# EAGLE design lcd13264-shield (EAGLE 6.5.0)
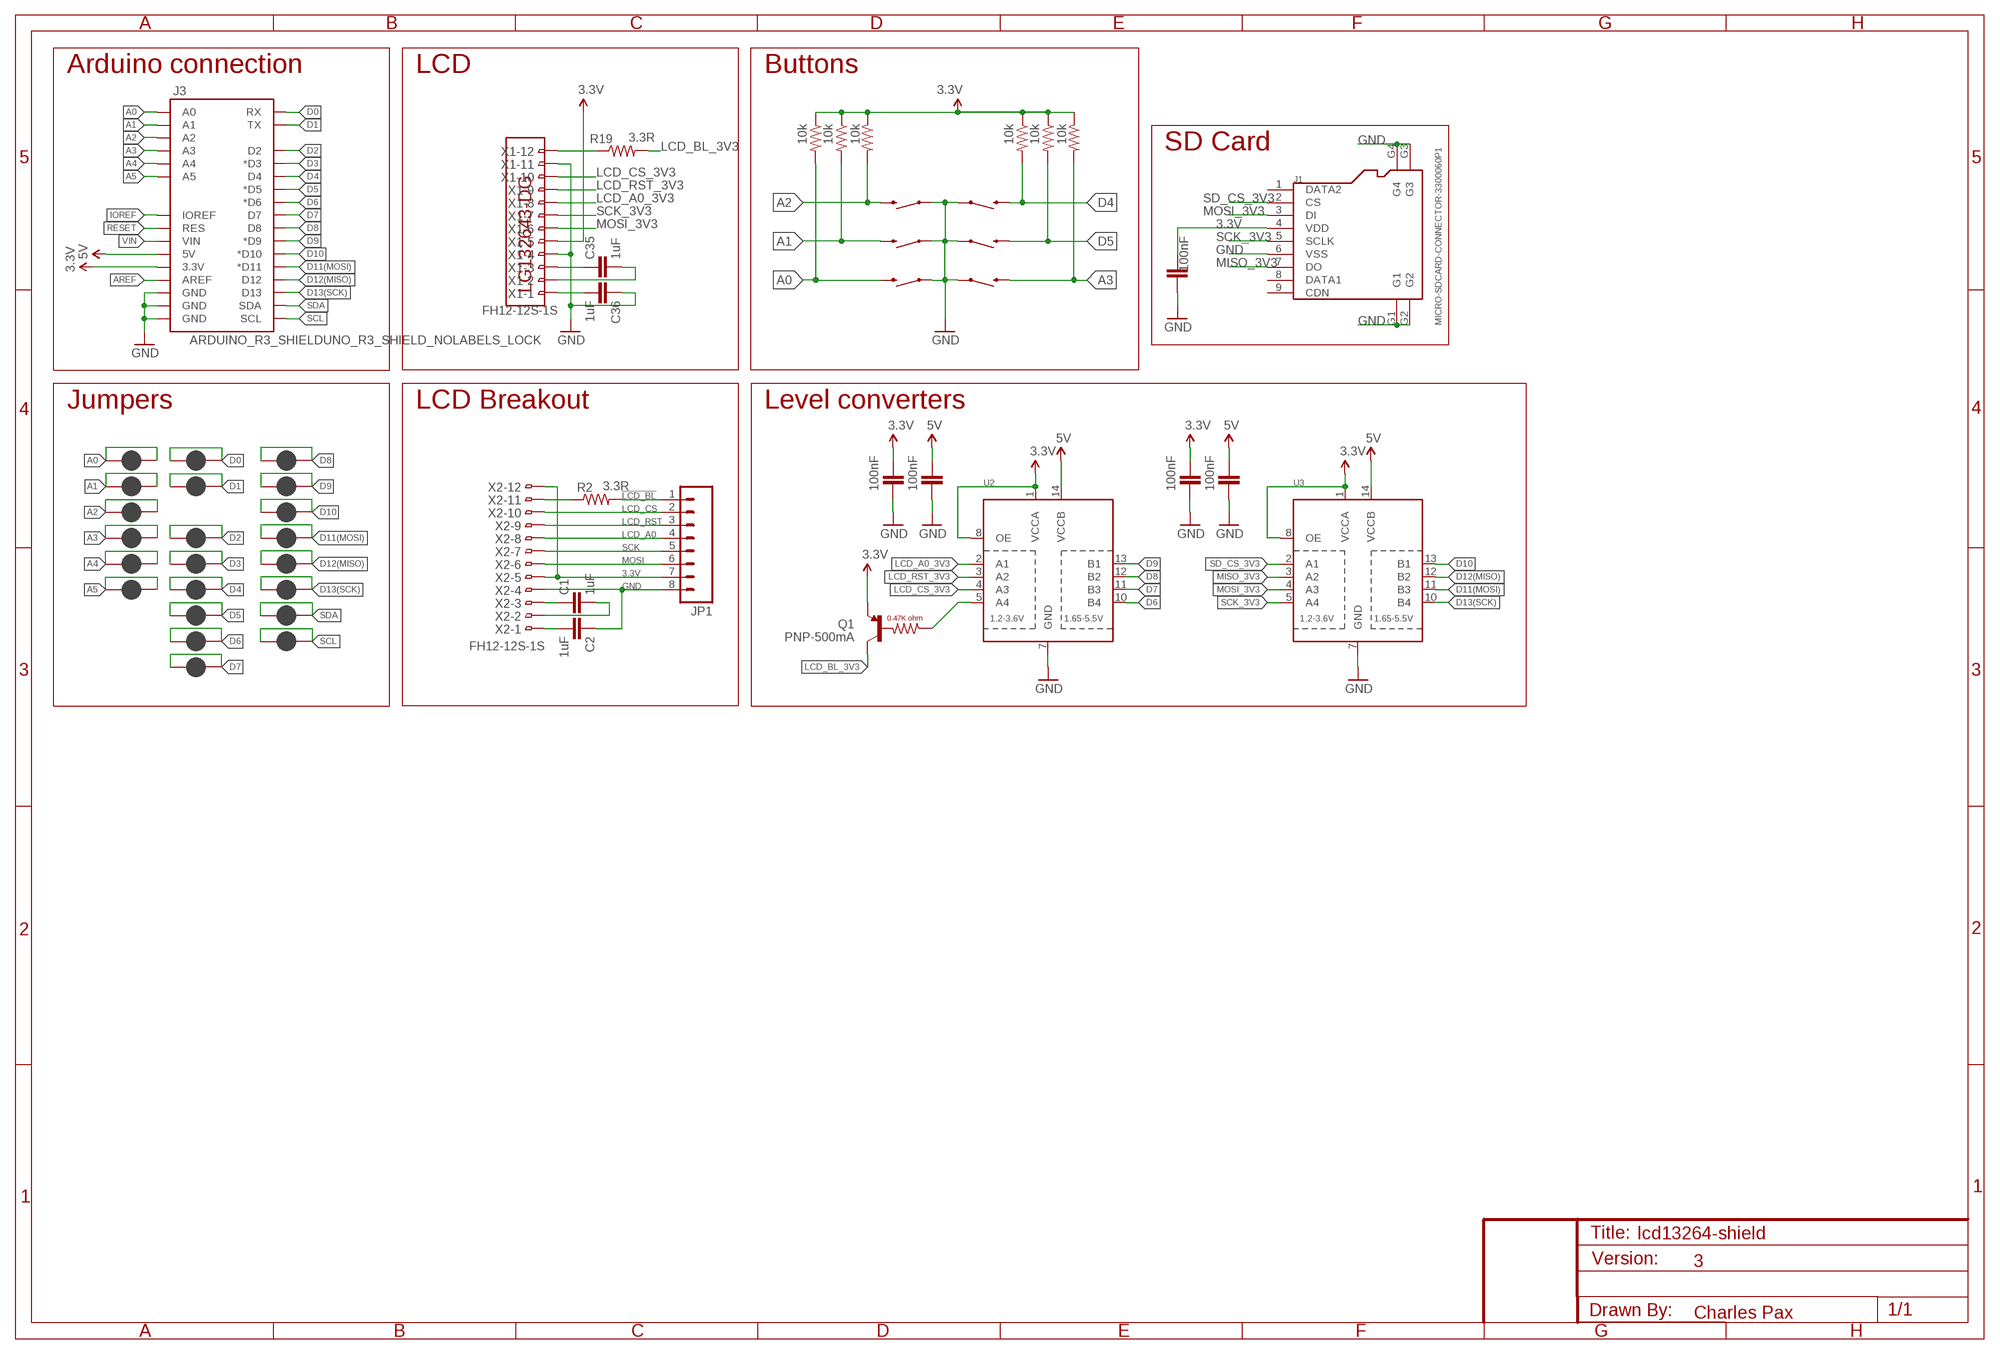
[diagram p0: schematic, sheet 1]

## Parts
C1  1uF  SPARKFUN-CAPACITORS_CAP0603-CAP  [SPARKFUN-CAPACITORS_0603-CAP]
C2  1uF  SPARKFUN-CAPACITORS_CAP0603-CAP  [SPARKFUN-CAPACITORS_0603-CAP]
C3  100nF  SPARKFUN-CAPACITORS_CAP0603-CAP  [SPARKFUN-CAPACITORS_0603-CAP]
C4  100nF  SPARKFUN-CAPACITORS_CAP0603-CAP  [SPARKFUN-CAPACITORS_0603-CAP]
C5  100nF  SPARKFUN-CAPACITORS_CAP0603-CAP  [SPARKFUN-CAPACITORS_0603-CAP]
C6  100nF  SPARKFUN-CAPACITORS_CAP0603-CAP  [SPARKFUN-CAPACITORS_0603-CAP]
C21  100nF  SPARKFUN-CAPACITORS_CAP0603-CAP  [SPARKFUN-CAPACITORS_0603-CAP]
C35  1uF  SPARKFUN-CAPACITORS_CAP0603-CAP  [SPARKFUN-CAPACITORS_0603-CAP]
C36  1uF  SPARKFUN-CAPACITORS_CAP0603-CAP  [SPARKFUN-CAPACITORS_0603-CAP]
J1  MICRO-SDCARD-CONNECTOR-3300060P1  [9P-SMD-W-RING]
J3  ARDUINO_R3_SHIELDUNO_R3_SHIELD_NOLABELS_LOCK  [UNO_R3_SHIELD_NOLABELS_LOCK]
JP1  M08  [1X08_ROUND]
Q1  PNP-500mA  TRANSISTOR-PNP-DDTB142TC  [SOT23-3]
R1  10k  SPARKFUN-RESISTORS_RESISTOR0603-RES  [SPARKFUN-RESISTORS_0603-RES]
R2  3.3R  SPARKFUN-RESISTORS_RESISTOR0603-RES  [SPARKFUN-RESISTORS_0603-RES]
R8  10k  SPARKFUN-RESISTORS_RESISTOR0603-RES  [SPARKFUN-RESISTORS_0603-RES]
R11  10k  SPARKFUN-RESISTORS_RESISTOR0603-RES  [SPARKFUN-RESISTORS_0603-RES]
R12  10k  SPARKFUN-RESISTORS_RESISTOR0603-RES  [SPARKFUN-RESISTORS_0603-RES]
R15  10k  SPARKFUN-RESISTORS_RESISTOR0603-RES  [SPARKFUN-RESISTORS_0603-RES]
R16  10k  SPARKFUN-RESISTORS_RESISTOR0603-RES  [SPARKFUN-RESISTORS_0603-RES]
R19  3.3R  SPARKFUN-RESISTORS_RESISTOR0603-RES  [SPARKFUN-RESISTORS_0603-RES]
S1  SWITCH-MOMENTARY-2SMD  [TACTILE_SWITCH_SMD]
S2  SWITCH-MOMENTARY-2SMD  [TACTILE_SWITCH_SMD]
S3  SWITCH-MOMENTARY-2SMD  [TACTILE_SWITCH_SMD]
S4  SWITCH-MOMENTARY-2SMD  [TACTILE_SWITCH_SMD]
S5  SWITCH-MOMENTARY-2SMD  [TACTILE_SWITCH_SMD]
S6  SWITCH-MOMENTARY-2SMD  [TACTILE_SWITCH_SMD]
SJ1  JUMPER-PAD-2-NC_BY_PASTE  [PAD-JUMPER-2-NC_BY_PASTE_YES_SILK]
SJ2  JUMPER-PAD-2-NC_BY_PASTE  [PAD-JUMPER-2-NC_BY_PASTE_YES_SILK]
SJ3  JUMPER-PAD-2-NC_BY_PASTE  [PAD-JUMPER-2-NC_BY_PASTE_YES_SILK]
SJ4  JUMPER-PAD-2-NC_BY_PASTE  [PAD-JUMPER-2-NC_BY_PASTE_YES_SILK]
SJ5  JUMPER-PAD-2-NC_BY_PASTE  [PAD-JUMPER-2-NC_BY_PASTE_YES_SILK]
SJ6  JUMPER-PAD-2-NC_BY_PASTE  [PAD-JUMPER-2-NC_BY_PASTE_YES_SILK]
SJ7  JUMPER-PAD-2-NC_BY_PASTE  [PAD-JUMPER-2-NC_BY_PASTE_YES_SILK]
SJ8  JUMPER-PAD-2-NC_BY_PASTE  [PAD-JUMPER-2-NC_BY_PASTE_YES_SILK]
SJ9  JUMPER-PAD-2-NC_BY_PASTE  [PAD-JUMPER-2-NC_BY_PASTE_YES_SILK]
SJ10  JUMPER-PAD-2-NC_BY_PASTE  [PAD-JUMPER-2-NC_BY_PASTE_YES_SILK]
SJ11  JUMPER-PAD-2-NC_BY_PASTE  [PAD-JUMPER-2-NC_BY_PASTE_YES_SILK]
SJ12  JUMPER-PAD-2-NC_BY_PASTE  [PAD-JUMPER-2-NC_BY_PASTE_YES_SILK]
SJ13  JUMPER-PAD-2-NC_BY_PASTE  [PAD-JUMPER-2-NC_BY_PASTE_YES_SILK]
SJ14  JUMPER-PAD-2-NC_BY_PASTE  [PAD-JUMPER-2-NC_BY_PASTE_YES_SILK]
SJ19  JUMPER-PAD-2-NC_BY_PASTE  [PAD-JUMPER-2-NC_BY_PASTE_YES_SILK]
SJ20  JUMPER-PAD-2-NC_BY_PASTE  [PAD-JUMPER-2-NC_BY_PASTE_YES_SILK]
SJ21  JUMPER-PAD-2-NC_BY_PASTE  [PAD-JUMPER-2-NC_BY_PASTE_YES_SILK]
SJ22  JUMPER-PAD-2-NC_BY_PASTE  [PAD-JUMPER-2-NC_BY_PASTE_YES_SILK]
SJ23  JUMPER-PAD-2-NC_BY_PASTE  [PAD-JUMPER-2-NC_BY_PASTE_YES_SILK]
SJ24  JUMPER-PAD-2-NC_BY_PASTE  [PAD-JUMPER-2-NC_BY_PASTE_YES_SILK]
SJ25  JUMPER-PAD-2-NC_BY_PASTE  [PAD-JUMPER-2-NC_BY_PASTE_YES_SILK]
SJ26  JUMPER-PAD-2-NC_BY_PASTE  [PAD-JUMPER-2-NC_BY_PASTE_YES_SILK]
U2  TXB0104PWRSOIC14  [SO14]
U3  TXB0104PWRSOIC14  [SO14]
U$5  LG132643-DG  [LG132643-DG]
X1  FH12-12S-1S  [FH12-12S-1SH]
X2  FH12-12S-1S  [FH12-12S-1SH]

## Nets
3.3V: C3.2 C5.2 C21.2 J1.4(VDD) J3.3.3V Q1.2(E) R1.1 R8.1 R11.1 R12.1 R15.1 R16.1 U2.1(VCCA) U2.8(OE) U3.1(VCCA) U3.8(OE) X1.5
5V: C4.2 C6.2 J3.5V U2.14(VCCB) U3.14(VCCB)
A0: J3.A0 R1.2 S6.3 SJ10.1 SJ10.2
A1: J3.A1 R16.2 S5.3 SJ7.1 SJ7.2
A2: J3.A2 R15.2 S4.3 SJ11.1 SJ11.2
A3: J3.A3 R12.2 S1.3 SJ12.1 SJ12.2
A4: J3.A4 SJ13.1 SJ13.2
A5: J3.A5 SJ14.1 SJ14.2
AREF: J3.AREF
D0: J3.RX SJ8.1 SJ8.2
D1: J3.TX SJ9.1 SJ9.2
D2: J3.D2 SJ3.1 SJ3.2
D3: J3.D3(*D3) SJ4.1 SJ4.2
D4: J3.D4 R8.2 S3.3 SJ5.1 SJ5.2
D5: J3.D5(*D5) R11.2 S2.3 SJ6.1 SJ6.2
D6: J3.D6(*D6) SJ19.1 SJ19.2 U2.10(B4)
D7: J3.D7 SJ20.1 SJ20.2 U2.11(B3)
D8: J3.D8 SJ21.1 SJ21.2 U2.12(B2)
D9: J3.D9(*D9) SJ22.1 SJ22.2 U2.13(B1)
D10: J3.D10(*D10) SJ23.1 SJ23.2 U3.13(B1)
D11(MOSI): J3.D11(*D11) SJ24.1 SJ24.2 U3.11(B3)
D12(MISO): J3.D12 SJ25.1 SJ25.2 U3.12(B2)
D13(SCK): J3.D13 SJ26.1 SJ26.2 U3.10(B4)
GND: C2.1 C3.1 C4.1 C5.1 C6.1 C21.1 C36.1 J1.6(VSS) J1.G1 J1.G2 J1.G3 J1.G4 J3.GND@0(GND) J3.GND@1(GND) J3.GND@2(GND) JP1.8 S1.1 S2.1 S3.1 S4.1 S5.1 S6.1 U2.7(GND) U3.7(GND) X1.4 X1.11 X2.4
IOREF: J3.IOREF
LCD_A0_3V3: U2.2(A1) X1.8
LCD_BL_3V3: Q1.3(C) R19.2
LCD_CS_3V3: U2.4(A3) X1.10
LCD_RST_3V3: U2.3(A2) X1.9
MISO_3V3: J1.7(DO) U3.3(A2)
MOSI_3V3: J1.3(DI) U3.4(A3) X1.6
N$4: R19.1 X1.12
N$37: C35.1 X1.3
N$38: C35.2 X1.2
N$39: C36.2 X1.1
N$40: C1.1 X2.3
N$41: C1.2 X2.2
N$42: C2.2 X2.1
N$43: R2.1 X2.11
N$47: JP1.7 X2.5 X2.12
N$51: JP1.1 R2.2
N$52: JP1.2 X2.10
N$53: JP1.3 X2.9
N$54: JP1.4 X2.8
N$55: JP1.5 X2.7
N$56: JP1.6 X2.6
N$57: Q1.1(B) U2.5(A4)
RESET: J3.RES
SCK_3V3: J1.5(SCLK) U3.5(A4) X1.7
SCL: J3.SCL SJ2.1 SJ2.2
SD_CS_3V3: J1.2(CS) U3.2(A1)
SDA: J3.SDA SJ1.1 SJ1.2
VIN: J3.VIN
Unconnected: J1.1(DATA2) J1.8(DATA1) J1.9(CDN)

## Notes on the sheet
- Arduino connection | LCD | Buttons
- SD Card
- Jumpers | LCD Breakout | Level converters
- !LCD_BL
- LCD_CS
- LCD_RST
- LCD_A0
- SCK
- MOSI
- 3.3V
- GND
- 3
- Charles Pax

## Library data of the parts
C1 C2 C35 C36 = PaxInstrument-T400:SPARKFUN-CAPACITORS_CAP: Capacitor Standard 0603 ceramic capacitor, and 0.1" leaded capacitor.; MPN: LMK107B7105KA-T; OC_DIGIKEY: 587-1242-2-ND
C3-C6 C21 = PaxInstrument-T400:SPARKFUN-CAPACITORS_CAP: Capacitor Standard 0603 ceramic capacitor, and 0.1" leaded capacitor.; MPN: CL10B104KO8NNNC; OC_DIGIKEY: 1276-1005-2-ND
J1 = PaxInstrument-T400:MICRO-SDCARD-CONNECTOR: Micro SD Card
J3 = SparkFun-Boards:ARDUINO_R3_SHIELD: Shield form compatible with the Arduino Uno R3.
JP1 = SparkFun-Connectors:M08: Header 8 Standard 8-pin 0.1" header. Use with straight break away headers (SKU : PRT-00116), right angle break away headers (PRT-00553), swiss pins (PRT-00743), machine pins (PRT-00117), and female headers (PRT-00115).
Q1 = SparkFun-DiscreteSemi:TRANSISTOR-PNP-DDTB142TC: PNP transistor with base resistor.; MPN: DDTB142TC; OC_DIGIKEY: DDTB142TC; OC_MOUSER: 621-DDTB142TC-F; PROD_ID: TRANS-11479
R1 R8 R11 R12 R15 R16 = PaxInstrument-T400:SPARKFUN-RESISTORS_RESISTOR: Resistor Basic schematic elements and footprints for 0603, 1206, and PTH resistors.; MPN: RC1608J103CS; OC_DIGIKEY: 1276-5086-2-ND
R2 R19 = PaxInstrument-T400:SPARKFUN-RESISTORS_RESISTOR: Resistor Basic schematic elements and footprints for 0603, 1206, and PTH resistors.
S1-S6 = SparkFun-Electromechanical:SWITCH-MOMENTARY-2: Various NO switches- pushbuttons, reed, etc
SJ1-SJ14 SJ19-SJ26 = SparkFun-Passives:JUMPER-PAD-2-NC_BY_PASTE
U2 U3 = SparkFun-DigitalIC:TXB0104PWR: 4-Bit Bi-Directional Level Shifter 1.2V-3.6V (VCCA) to 1.65V-5.5V (VCCB) bi-directional level shifter with auto direction sensing. Max data rate - VCCA 1.8V: 20Mbps (50ns), VCCA 3.3V: 100Mbps (10ns) Digikey: 296-21929-1-ND (TSSOP) IC-11329; MPN: TXB0104DR; OC_DIGIKEY: 296-21928-2-ND; PROD_ID: IC-11329
U$5 = charlespax:LG132643-DG; MPN: LG132643-DW
X1 X2 = PaxInstrument-T400:FH12-12S-1S

## Net classes
0 default: width 0.203 mm, drill 0.33 mm
1 power: width 0.305 mm

## Board
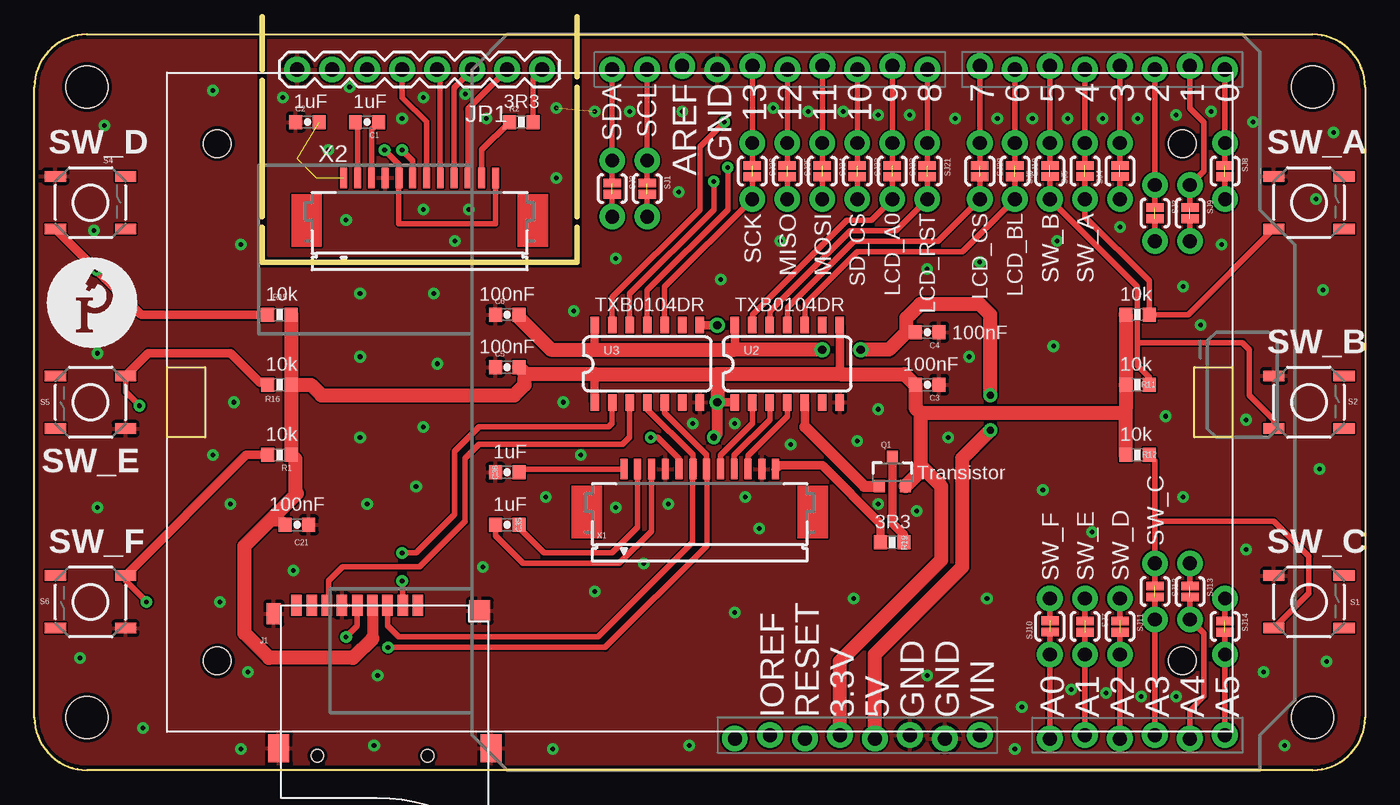
[diagram p1: board, top side]
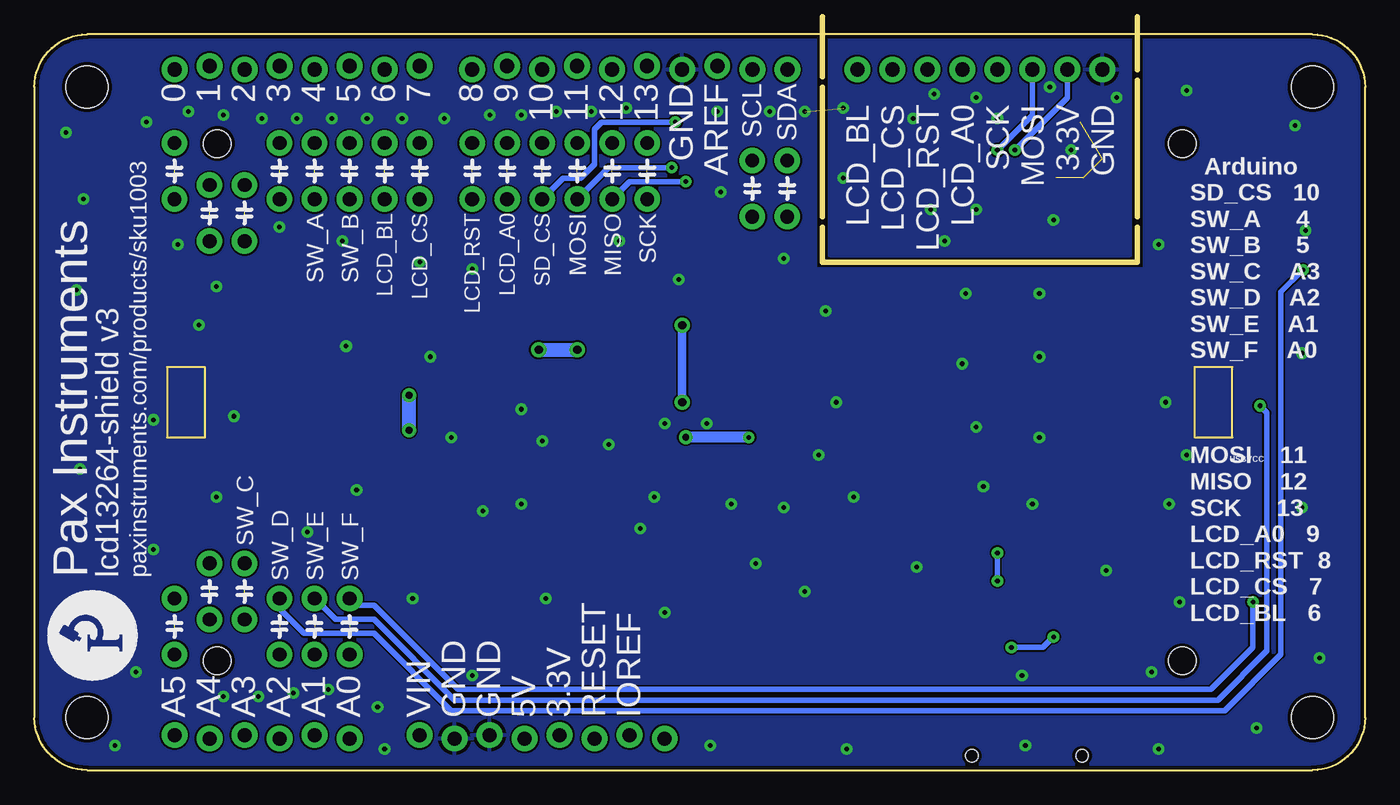
[diagram p2: board, bottom side, seen from below]

Size 96.52 x 53.34 mm. Coordinates in mm from the lower left corner, seen from the top.
Outline: 92.71,0 3.81,0 arc-90 0,3.81 0,49.53 arc-90 3.81,53.34 92.71,53.34 arc-90 96.52,49.53 96.52,3.81 arc-90 92.71,0
Copper layers (1*16): Top 0.035mm / dielectric 1.5mm / Bottom 0.035mm
Design rules "PaxInstrument-T400 *": minimum track width 6mil, minimum drill 13mil, track to track 5mil, track to pad 5mil, pad to pad 5mil, via to via 5mil, smd to smd 5mil, copper to edge 10mil, drill to drill 8mil, minimum pad ring 12mil, minimum via ring 10mil, stop-mask expansion 4mil, vias tented up to drill 25mil, thermal gap 10mil
Holes 3.05 mm at 3.81,49.53 92.71,49.53 92.71,3.81 3.81,3.81
Milling: 7 lines

### Footprints (pad centres in the part's own frame; a part is rotated, then mirrored left to right if it is on the bottom)
SPARKFUN-CAPACITORS_0603-CAP = smd 0.94 x 1.016: 1 -0.85,0; 2 0.85,0
9P-SMD-W-RING = smd 1.524 x 0.762: 1 -7.493,2.414; 2 -7.493,1.314; 3 -7.493,0.214; 4 -7.493,-0.886; 5 -7.493,-1.986; 6 -7.493,-3.086; 7 -7.493,-4.186; 8 -7.493,-5.286; 9 -7.493,-6.386 | smd 1.524 x 1.016: G1 -6.893,-8.032 | smd 2.032 x 1.524: G2 2.88,-7.686; G3 2.88,7.714 | smd 1.524 x 1.524: G4 -7.101,6.895 | hole 0.889: 3.407,-4.886; 3.407,3.114
UNO_R3_SHIELD_NOLABELS_LOCK = drill 1.016 pad 1.88: 3.3V 50.8,26.67; 5V 51.054,29.21; A0 51.054,41.91; A1 50.8,44.45; A2 51.054,46.99; A3 50.8,49.53; A4 51.054,52.07; A5 50.8,54.61; AREF 2.286,15.24; D2 2.54,49.53; D3 2.286,46.99; D4 2.54,44.45; D5 2.286,41.91; D6 2.54,39.37; D7 2.286,36.83; D8 2.54,33.02; D9 2.286,30.48; D10 2.54,27.94; D11 2.286,25.4; D12 2.54,22.86; D13 2.286,20.32; GND@0 50.8,31.75; GND@1 51.054,34.29; GND@2 2.54,17.78; IOREF 50.8,21.59; NC 51.054,19.05; RES 51.054,24.13; RX 2.54,54.61; SCL 2.54,10.16; SDA 2.54,12.7; TX 2.286,52.07; VIN 50.8,36.83
1X08_ROUND = drill 1.016 pad 1.88: 1 0,0; 2 2.54,0; 3 5.08,0; 4 7.62,0; 5 10.16,0; 6 12.7,0; 7 15.24,0; 8 17.78,0
SOT23-3 = smd 0.8 x 0.9: 1 -0.95,-1; 2 0.95,-1; 3 0,1.1
SPARKFUN-RESISTORS_0603-RES = smd 0.94 x 1.016: 1 -0.85,0; 2 0.85,0
TACTILE_SWITCH_SMD = smd 1.524 x 0.762: 1 -2.54,1.905; 2 2.54,1.905; 3 -2.54,-1.905; 4 2.54,-1.905
PAD-JUMPER-2-NC_BY_PASTE_YES_SILK = smd 0.635 x 1.27: 1 -0.401,0; 2 0.413,0
SO14 = smd 0.6 x 1.2: 1 -3.81,-2.8; 2 -2.54,-2.8; 3 -1.27,-2.8; 4 0,-2.8; 5 1.27,-2.8; 6 2.54,-2.8; 7 3.81,-2.8; 8 3.81,2.8; 9 2.54,2.8; 10 1.27,2.8; 11 0,2.8; 12 -1.27,2.8; 13 -2.54,2.8; 14 -3.81,2.8
LG132643-DG = hole 2: -35,-18.75; 35,-18.75; 35,18.75; -35,18.75
FH12-12S-1SH = smd 0.5 x 1.5: 1 -5.5,2.297; 2 -4.5,2.297; 3 -3.5,2.297; 4 -2.5,2.297; 5 -1.5,2.297; 6 -0.5,2.297; 7 0.5,2.297; 8 1.5,2.297; 9 2.5,2.297; 10 3.5,2.297; 11 4.5,2.297; 12 5.5,2.297

### Placement (x,y rotation side)
C1  24.13,46.99 180 top
C2  19.81,46.99 0 top
C3  64.77,27.94 180 top
C4  64.77,31.75 180 top
C5  34.29,29.21 0 top
C6  34.29,33.02 0 top
C21  19.05,17.78 180 top
C35  34.29,17.78 0 top
C36  34.29,21.59 0 top
J1  25.4,4.45 270 top
J3  31.75,53.34 270 top
JP1  36.83,50.8 180 top
Q1  62.23,21.59 0 top
R1  17.78,22.86 180 top
R2  35.31,46.99 0 top
R8  80.01,33.02 0 top
R11  80.01,27.94 0 top
R12  80.01,22.86 0 top
R15  17.78,33.02 180 top
R16  17.78,27.94 180 top
R19  62.23,16.51 0 top
S1  92.46,12.19 0 top
S2  92.46,26.67 0 top
S3  92.46,41.15 0 top
S4  4.06,41.15 0 top
S5  4.06,26.67 180 top
S6  4.06,12.19 180 top
SJ1  44.45,42.16 270 top
SJ2  41.91,42.16 270 top
SJ3  81.28,40.39 270 top
SJ4  78.74,43.43 90 top
SJ5  76.2,43.43 90 top
SJ6  73.66,43.43 90 top
SJ7  76.2,10.41 270 top
SJ8  86.36,43.43 270 top
SJ9  83.82,40.39 270 top
SJ10  73.66,10.41 90 top
SJ11  78.74,10.41 270 top
SJ12  81.28,12.95 270 top
SJ13  83.82,12.95 270 top
SJ14  86.36,10.41 270 top
SJ19  71.12,43.43 270 top
SJ20  68.58,43.43 270 top
SJ21  64.77,43.43 270 top
SJ22  62.23,43.43 270 top
SJ23  59.69,43.43 270 top
SJ24  57.15,43.43 270 top
SJ25  54.61,43.43 270 top
SJ26  52.07,43.43 270 top
U2  54.61,29.46 0 top
U3  44.45,29.46 0 top
U$1  [PAXINSTRUMENT_LOGO]  0.76,30.48 0 top
U$5  48.26,26.67 0 bottom
U$6  [PAXINSTRUMENT_LOGO]  88.9,6.35 90 bottom
X1  48.26,19.52 0 top
X2  27.94,40.64 0 top

### Tracks (layer width: path | path; a pad name or v marks a point on that pad's centre or on a via)
3.3V  (via drill 0.33, 0.5, 0.6)
  Top 0.406: X1.5 46.76,22.58 45.21,24.13 v44.7,24.13
  Top 0.61: U3.8 v49.53,32.26 | v49.53,26.67 v49.54,26.66 U2.1 | U3.1 40.64,28.7 | U2.8 58.42,28.7
  Top 0.813: J1.4 24.51,9.53 | 64.26,22.1 64.26,21.67 | v49.28,24.13 49.53,24.38 v49.53,26.67 | C21.2 17.95,18.03 17.02,18.03
  Top 1.016: 49.53,28.7 40.64,28.7 35.81,28.7 | 49.53,28.7 v49.53,26.67 | 49.53,28.7 58.42,28.7 63.12,28.7 63.88,27.94 C3.2 63.92,26.25 64.26,25.91 | R8.1 R11.1 79.16,26.2 | 64.26,25.91 78.86,25.91 79.16,26.2 | R15.1 R16.1 | R16.1 R1.1 18.92,22.57 18.92,19.94 | 24.51,9.53 23.11,8.13 17.02,8.13 15.24,9.91 15.24,16.26 17.02,18.03 18.92,19.94 | 18.92,19.94 19.05,20.07 | R16.1 20.07,27.94 20.83,27.18 34.8,27.18 35.56,27.94 35.56,28.45 35.81,28.7 | 64.26,25.91 64.26,22.1 65.79,20.57 65.79,15.24 58.42,7.87 J3.3.3V | 64.26,21.67 Q1.2 | R12.1 79.16,26.2 | 35.81,28.7 35.65,28.7 C5.2
  Bottom 0.61: v49.53,32.26 v49.53,26.67
  Bottom 0.813: v44.7,24.13 v49.28,24.13
5V  (via drill 0.5, 0.6)
  Top 0.61: U3.14 40.64,30.48 | 50.8,30.48 50.8,30.73 | 50.8,30.73 U2.14 | 51.05,30.48 50.8,30.73
  Top 1.016: 50.8,30.48 40.64,30.48 37.47,30.48 35.14,32.81 C6.2 | v57.15,30.48 51.05,30.48 | v59.94,30.48 61.98,30.48 63.25,31.75 | J3.5V 60.96,8.38 67.31,14.73 67.31,22.61 v69.34,24.64 | v69.34,27.18 69.34,33.02 68.58,33.78 64.26,33.78 63.25,32.77 63.25,31.75 | 63.25,31.75 C4.2
  Bottom 1.016: v59.94,30.48 v57.15,30.48 | v69.34,24.64 v69.34,27.18
A0  (via drill 0.33, 1 pad 1.85)  (1 unrouted)
  Top 0.406: J3.A0 v73.66,8.38 SJ10.1 | v73.66,12.45 SJ10.2 | v8.13,12.19 6.6,13.72 S6.3
  Top 0.61: S6.3 15.37,22.86 R1.2
  Bottom 0.406: v73.66,12.45 73.15,11.94 71.88,11.94 65.79,5.84 11.18,5.84 8.13,8.89 v8.13,12.19
A1  (via drill 0.33, 1 pad 1.85)  (1 unrouted)
  Top 0.406: v76.2,12.45 SJ7.1 | SJ7.2 v76.2,8.38 J3.A1 | v7.62,26.42 6.6,27.43 S5.3 | 16.38,28.07 16.51,27.94 R16.2
  Top 0.61: S5.3 8.26,30.23 14.22,30.23 16.38,28.07
  Bottom 0.406: v76.2,12.45 74.68,10.92 71.88,10.92 66.04,5.08 10.67,5.08 7.11,8.64 7.11,25.91 v7.62,26.42
A2  (via drill 0.33, 1 pad 1.85)  (1 unrouted)
  Top 0.406: J3.A2 v78.74,8.38 SJ11.2 | v78.74,12.45 SJ11.1
  Top 0.61: S4.3 4.25,36.51 v4.51,36.26 7.75,33.02 R15.2
  Bottom 0.406: v78.74,12.45 78.74,11.68 76.96,9.91 71.88,9.91 66.29,4.32 10.16,4.32 6.1,8.38 6.1,34.67 v4.51,36.26
A3  (via drill 1 pad 1.85)  (1 unrouted)
  Top 0.406: J3.A3 v81.28,10.92 SJ12.2 | SJ12.1 v81.28,14.99 81.28,18.03 | 81.28,18.03 81.28,21.08 81.28,21.46 81.28,22.44 R12.2 | S1.3 92.46,12.83 92.46,15.49 89.92,18.03 81.28,18.03
A4  (via drill 1 pad 1.85)  (1 unrouted)
  Top 0.406: SJ13.2 v83.82,10.92 84.84,9.91 84.84,5.33 83.82,4.32 J3.A4 | v83.82,14.99 SJ13.1
A5  (via drill 1 pad 1.85)  (1 unrouted)
  Top 0.406: J3.A5 v86.36,8.38 SJ14.2 | v86.36,12.45 SJ14.1
D0  (via drill 1 pad 1.85)  (1 unrouted)
  Top 0.406: J3.RX v86.36,45.47 SJ8.1 | v86.36,41.4 SJ8.2
D1  (via drill 1 pad 1.85)  (1 unrouted)
  Top 0.406: v83.82,38.35 SJ9.2 | J3.TX 83.82,48.01 84.84,46.99 84.84,43.43 v83.82,42.42 SJ9.1
D2  (via drill 1 pad 1.85)  (1 unrouted)
  Top 0.406: J3.D2 v81.28,42.42 SJ3.1 | v81.28,38.35 SJ3.2
D3  (via drill 1 pad 1.85)  (1 unrouted)
  Top 0.406: J3.D3 v78.74,45.47 SJ4.2 | v78.74,41.4 SJ4.1
D4  (via drill 1 pad 1.85)  (1 unrouted)
  Top 0.406: J3.D4 v76.2,45.47 SJ5.2 | SJ5.1 v76.2,41.4 76.2,40.13 80.86,35.47 R8.2 83.69,33.02 S3.3
D5  (via drill 1 pad 1.85)  (1 unrouted)
  Top 0.406: J3.D5 v73.66,45.47 SJ6.2 | SJ6.1 v73.66,41.4 80.01,35.05 80.01,30.99 | S2.3 89.92,25.4 88.14,27.18 88.14,30.48 87.63,30.99 80.01,30.99 | 80.01,30.99 80.01,29.34 80.86,28.49 R11.2
D6  (via drill 1 pad 1.85)  (1 unrouted)
  Top 0.406: J3.D6 v71.12,45.47 SJ19.1 | SJ19.2 v71.12,41.4 67.31,37.59 59.69,37.59 55.88,33.78 U2.10
D7  (via drill 1 pad 1.85)  (1 unrouted)
  Top 0.406: J3.D7 v68.58,45.47 SJ20.1 | SJ20.2 v68.58,41.4 65.53,38.35 59.44,38.35 54.61,33.53 U2.11
D8  (via drill 1 pad 1.85)  (1 unrouted)
  Top 0.406: J3.D8 v64.77,45.47 SJ21.1 | SJ21.2 v64.77,41.4 62.48,39.12 59.18,39.12 53.34,33.27 U2.12
D9  (via drill 1 pad 1.85)  (1 unrouted)
  Top 0.406: J3.D9 v62.23,45.47 SJ22.1 | SJ22.2 v62.23,41.4 60.71,39.88 58.93,39.88 52.07,33.02 U2.13
D10  (via drill 0.33, 1 pad 1.85)  (1 unrouted)
  Top 0.406: J3.D10 v59.69,45.47 SJ23.1 | v59.69,41.4 SJ23.2 | v50.04,46.99 48.26,45.21 48.26,40.64 41.91,34.29 U3.13
  Bottom 0.406: v59.69,41.4 58.17,42.93 56.9,42.93 55.88,43.94 55.88,46.48 55.37,46.99 v50.04,46.99
D11(MOSI)  (via drill 0.33, 1 pad 1.85)  (1 unrouted)
  Top 0.406: J3.D11 v57.15,45.47 SJ24.1 | SJ24.2 v57.15,41.4 | U3.11 44.45,34.8 50.29,40.64 v50.29,43.69
  Bottom 0.406: v57.15,41.4 54.86,43.69 v50.29,43.69
D12(MISO)  (via drill 0.33, 1 pad 1.85)  (1 unrouted)
  Top 0.406: J3.D12 v54.61,45.47 SJ25.1 | v54.61,41.4 SJ25.2 | U3.12 43.18,34.54 49.28,40.64 v49.28,42.67
  Bottom 0.406: v54.61,41.4 53.34,42.67 v49.28,42.67
D13(SCK)  (via drill 1 pad 1.85)  (1 unrouted)
  Top 0.406: J3.D13 v52.07,45.47 SJ26.1 | SJ26.2 v52.07,41.4 45.72,35.05 U3.10
GND  (via drill 0.33)  (1 unrouted)
  other vias: 28.19,40.64 31.5,40.64 28.19,48.77 26.67,47.24 22.86,49.53 18.03,48.77 21.34,44.96 32.77,47.24 37.85,48.01 37.85,42.93 22.61,39.88 31.24,49.02 30.48,38.35 47.75,25.15 51.56,19.81 39.62,22.86 38.35,26.67 50.8,25.15 54.86,23.62 45.97,19.3 44.2,14.99 40.64,12.95 32.51,14.73 37.08,19.81 42.16,19.05 52.58,17.53 61.21,26.16 59.69,23.88 49.78,35.56 39.12,33.27 29.21,29.46 28.96,34.54 23.62,34.54 23.62,29.97 28.19,24.89 27.69,20.57 23.62,24.13 24.13,19.3 54.1,38.35 46.99,47.75 46.74,41.91 42.16,37.08 40.64,47.75 43.18,47.75 53.59,48.01 56.13,47.75 58.67,47.75 61.21,47.5 63.5,47.5 66.8,47.24 69.85,47.24 72.39,47.24 74.93,47.24 77.47,47.24 80.01,47.24 82.8,47.5 85.34,47.75 88.39,46.99 78.74,39.37 74.17,38.35 64.77,36.32 68.58,36.83 94.23,46.23 86.11,38.1 83.31,35.05 84.58,32.26 93.47,34.8 82.04,25.65 87.88,25.4 93.22,21.84 83.31,19.81 87.88,16 93.73,7.87 89.15,7.11 82.8,5.33 80.26,5.33 77.72,5.59 75.18,5.84 71.63,4.57 90.68,1.78 64.77,6.86 69.09,12.45 76.71,17.27 73.15,20.32 66.29,24.13 73.91,30.73 67.82,29.97 64.01,18.8 59.44,12.45 50.8,11.43 47.5,1.78 37.59,1.52 71.12,1.52 92.96,41.4 24.89,6.86 15.49,7.11 14.99,1.52 24.64,1.78 7.87,3.05 3.3,8.13 4.57,19.05 14.22,19.3 13.46,12.19 18.8,14.48 14.48,26.67 12.95,22.86 4.57,30.23 4.32,39.12 5.08,46.74 12.95,49.28 14.99,38.1 61.21,19.3
  pour Bottom: 96.52,53.34 96.52,0 0,0 0,53.34 16,53.34 16,36.32 39.88,36.32 39.88,53.34
  pour Top: 96.52,53.34 96.52,0 0,0 0,53.34 16,53.34 16,36.32 39.88,36.32 39.88,53.34
  pour Top: 38.86,53.34 38.86,37.34 17.02,37.34 17.02,53.34
  pour Bottom: 38.86,53.34 38.86,37.34 17.02,37.34 17.02,53.34
LCD_A0_3V3
  Top 0.406: U2.2 52.07,25.15 49.76,22.84 X1.8
LCD_BL_3V3
  Top 0.61: Q1.3 62.23,17.91 63.08,17.06 R19.2
LCD_CS_3V3
  Top 0.406: U2.4 54.61,25.65 51.76,22.8 X1.10
LCD_RST_3V3
  Top 0.406: U2.3 53.34,25.4 50.76,22.82 X1.9
MISO_3V3
  Top 0.406: J1.7 21.34,12.06 21.34,13.72 22.35,14.73 27.94,14.73 31.24,18.03 31.24,22.61 32.26,23.62 42.67,23.62 43.18,24.13 U3.3
MOSI_3V3
  Top 0.406: U3.4 44.45,26.16 47.76,22.85 X1.6 47.75,16.51 40.89,9.65 26.42,9.65 25.61,10.45 J1.3
N$4
  Top 0.61: X1.12 54.03,22.1 57.15,22.1 61.38,17.87 R19.1
N$37
  Top 0.406: X1.3 44.76,17.33 42.42,14.99 35.43,14.99 33.44,16.98 C35.1
N$38
  Top 0.406: X1.2 43.76,17.6 41.91,15.75 36.96,15.75 35.14,17.57 C35.2
N$39
  Top 0.406: X1.1 35.37,21.82 C36.2
N$40
  Top 0.406: X2.3 24.44,46.45 C1.1
N$41
  Top 0.406: X2.2 23.44,46.83 C1.2
N$42  (3 unrouted)
N$43
  Top 0.406: R2.1 32.44,44.97 X2.11
N$47  (via drill 0.33)
  Top 0.406: v25.4,44.96 26.42,43.94 26.42,42.96 X2.5 26.42,42.91 26.42,39.62 33.44,39.62 X2.12
  Bottom 0.406: JP1.7 21.59,48.77 v25.4,44.96
N$51
  Top 0.406: JP1.1 36.16,50.13 R2.2
N$52
  Top 0.406: JP1.2 31.44,47.95 X2.10
N$53
  Top 0.406: JP1.3 30.44,49.49 X2.9
N$54
  Top 0.406: JP1.4 29.44,50.57 X2.8
N$55
  Top 0.406: X2.7 28.44,47 26.67,48.77 JP1.5
N$56  (via drill 0.33)
  Top 0.406: v26.67,44.96 27.43,44.2 X2.6
  Bottom 0.406: JP1.6 24.13,47.5 v26.67,44.96
N$57
  Top 0.61: U2.5 55.88,24.89 | 61.26,20.57 Q1.1
  Top 0.813: 55.88,24.89 60.2,20.57 61.26,20.57
SCK_3V3  (via drill 0.33)
  Top 0.406: U3.5 45.72,25.91 48.76,22.87 X1.7 48.77,16.26 41.4,8.89 v25.65,8.89 | v22.61,9.65 23.41,10.46 J1.5
  Bottom 0.406: v25.65,8.89 23.37,8.89 v22.61,9.65
SCL  (via drill 1 pad 1.85)  (1 unrouted)
  Top 0.406: J3.SCL v41.91,44.2 SJ2.1 | v41.91,40.13 SJ2.2
SD_CS_3V3  (via drill 0.33)
  Top 0.406: U3.2 41.91,25.15 41.66,24.89 32.26,24.89 30.48,23.11 30.48,18.54 27.69,15.75 v26.67,15.75 | J1.2 26.71,13.67 v26.67,13.72
  Bottom 0.406: v26.67,13.72 v26.67,15.75
SDA  (via drill 1 pad 1.85)  (1 unrouted)
  Top 0.406: v44.45,40.13 SJ1.2 | J3.SDA v44.45,44.2 SJ1.1

### Text on the board
tPlace: SDA | SCL | AREF | GND | 13 | 12 | 11 | 10 | 9 | 8 | 7 | 6 | 5 | 4 | 3 | 2 | 1 | 0 | 1uF | 1uF | 3R3 | SW_D | SW_A | SCK | MISO | MOSI | SD_CS | LCD_A0 | LCD_RST | LCD_CS | LCD_BL | SW_B | SW_A | 10k | 100nF | 10k | TXB0104DR | TXB0104DR | 100nF | 100nF | SW_B | 10k | 100nF | 10k | 10k | 10k | SW_E | 1uF | Transistor | 100nF | 1uF | 3R3 | SW_F | SW_C | SW_C | SW_F | SW_E | SW_D | IOREF | RESET | 3.3V | 5V | GND | GND | VIN | A0 | A1 | A2 | A3 | A4 | A5
bPlace: SDA | SCL | AREF | GND | 13 | 12 | 11 | 10 | 9 | 8 | 7 | 6 | 5 | 4 | 3 | 2 | 1 | 0 | GND | 3.3V | MOSI | SCK | LCD_A0 | LCD_RST | LCD_CS | LCD_BL | Arduino / SD_CS 10 / SW_A 4 / SW_B 5 / SW_C A3 / SW_D A2 / SW_E A1 / SW_F A0 / / / / MOSI 11 / MISO 12 / SCK 13 / LCD_A0 9 / LCD_RST 8 / LCD_CS 7 / LCD_BL 6 | SCK | MISO | MOSI | SD_CS | LCD_A0 | LCD_RST | LCD_CS | LCD_BL | SW_B | SW_A | USBVCC | SW_C | SW_F | SW_E | SW_D | paxinstruments.com/products/sku1003 | lcd13264-shield v3 | Pax Instruments | IOREF | RESET | 3.3V | 5V | GND | GND | VIN | A0 | A1 | A2 | A3 | A4 | A5